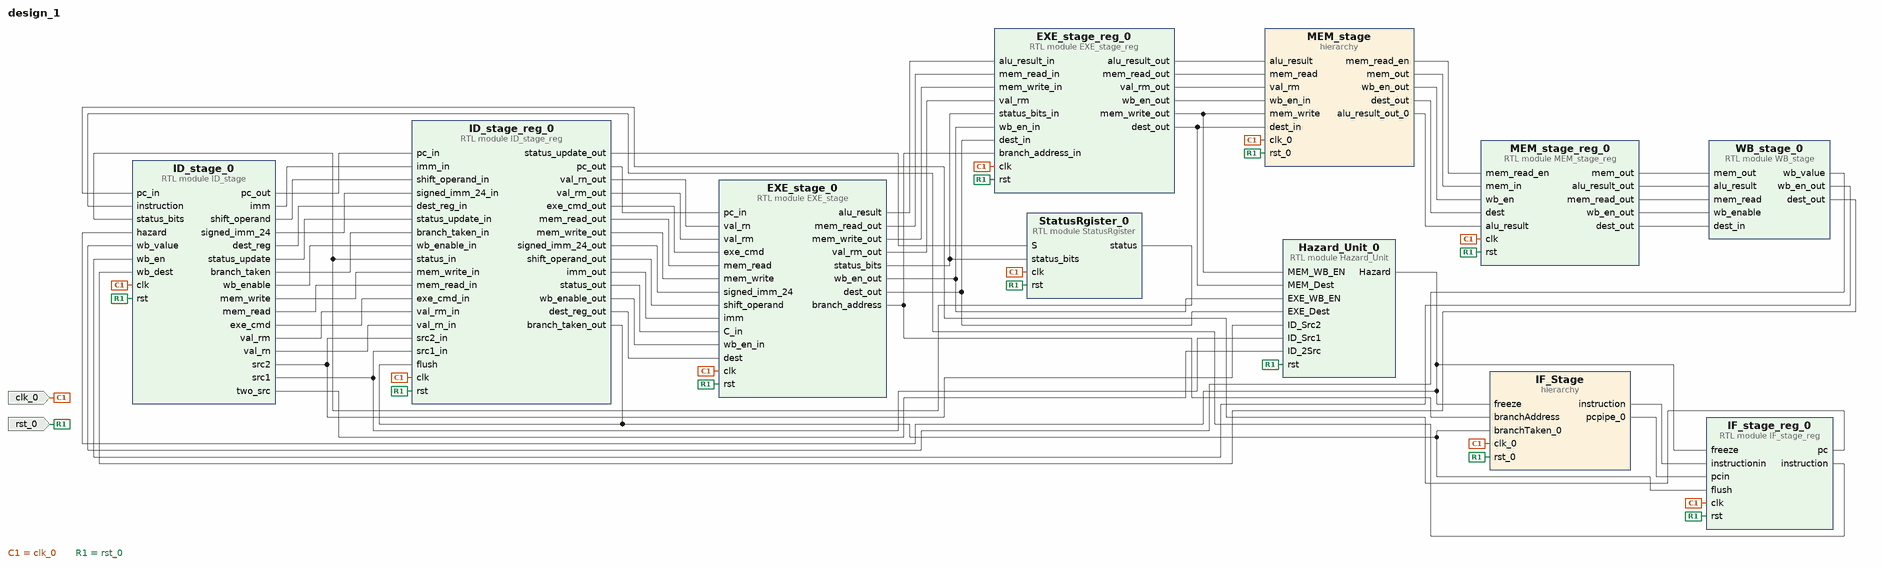
[diagram p0: block diagram of the top level]
# Vivado block design design_1, xc7z010clg400-1, Vivado 2018.3
create_bd_design design_1

create_bd_port -dir I -type clk clk_0
create_bd_port -dir I -type rst rst_0

create_bd_cell -type hier IF_Stage
create_bd_cell -type module -reference ID_stage_reg ID_stage_reg_0
create_bd_cell -type hier MEM_stage
create_bd_cell -type module -reference MEM_stage_reg MEM_stage_reg_0
create_bd_cell -type module -reference IF_stage_reg IF_stage_reg_0
create_bd_cell -type module -reference Hazard_Unit Hazard_Unit_0
create_bd_cell -type module -reference StatusRgister StatusRgister_0
create_bd_cell -type module -reference EXE_stage_reg EXE_stage_reg_0
create_bd_cell -type module -reference ID_stage ID_stage_0
create_bd_cell -type module -reference EXE_stage EXE_stage_0
create_bd_cell -type module -reference WB_stage WB_stage_0

# ---- hierarchy /IF_Stage ----
current_bd_instance /IF_Stage
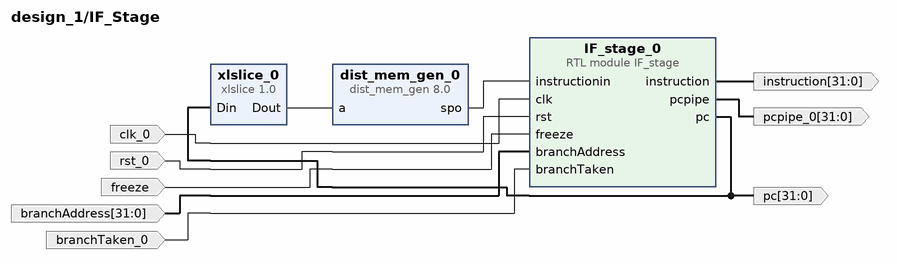
[diagram p1: block diagram inside /IF_Stage]
create_bd_pin -dir O -from 31 -to 0 pc
create_bd_pin -dir I -type clk clk_0
create_bd_pin -dir I -type rst rst_0
create_bd_pin -dir I freeze
create_bd_pin -dir I -from 31 -to 0 branchAddress
create_bd_pin -dir O -from 31 -to 0 instruction
create_bd_pin -dir O -from 31 -to 0 pcpipe_0
create_bd_pin -dir I branchTaken_0

create_bd_cell -type ip -vlnv xilinx.com:ip:xlslice:1.0 xlslice_0
set_property -dict {CONFIG.DIN_FROM 12 CONFIG.DOUT_WIDTH 13} [get_bd_cells xlslice_0]
create_bd_cell -type ip -vlnv xilinx.com:ip:dist_mem_gen:8.0 dist_mem_gen_0
set_property -dict [list \
  CONFIG.coefficient_file ../../../../../../../output_ultimate.coe \
  CONFIG.data_width 32 \
  CONFIG.depth 8192 \
  CONFIG.memory_type rom \
] [get_bd_cells dist_mem_gen_0]
create_bd_cell -type module -reference IF_stage IF_stage_0

# ---- hierarchy /MEM_stage ----
current_bd_instance /MEM_stage
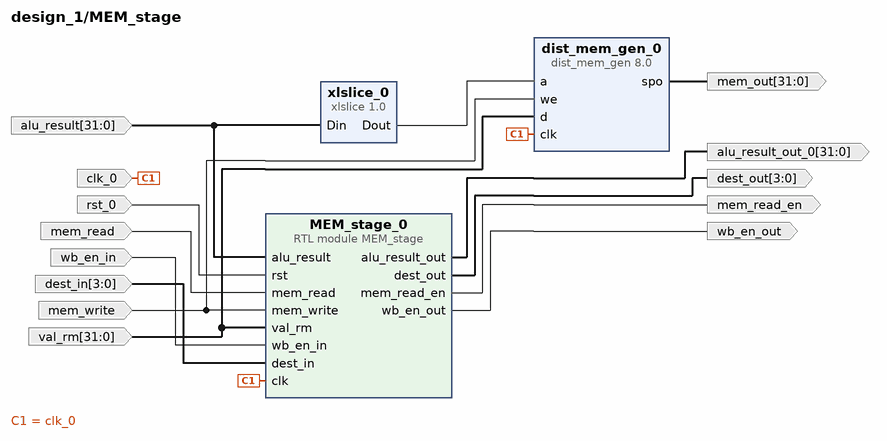
[diagram p2: block diagram inside /MEM_stage]
create_bd_pin -dir I -type clk clk_0
create_bd_pin -dir I -type rst rst_0
create_bd_pin -dir I mem_read
create_bd_pin -dir I mem_write
create_bd_pin -dir I -from 31 -to 0 alu_result
create_bd_pin -dir I -from 31 -to 0 val_rm
create_bd_pin -dir I wb_en_in
create_bd_pin -dir I -from 3 -to 0 dest_in
create_bd_pin -dir O -from 31 -to 0 mem_out
create_bd_pin -dir O mem_read_en
create_bd_pin -dir O wb_en_out
create_bd_pin -dir O -from 3 -to 0 dest_out
create_bd_pin -dir O -from 31 -to 0 alu_result_out_0

create_bd_cell -type ip -vlnv xilinx.com:ip:dist_mem_gen:8.0 dist_mem_gen_0
set_property -dict {CONFIG.data_width 32 CONFIG.depth 2048 CONFIG.memory_type single_port_ram} [get_bd_cells dist_mem_gen_0]
create_bd_cell -type ip -vlnv xilinx.com:ip:xlslice:1.0 xlslice_0
set_property -dict {CONFIG.DIN_FROM 10 CONFIG.DOUT_WIDTH 11} [get_bd_cells xlslice_0]
create_bd_cell -type module -reference MEM_stage MEM_stage_0

# ---- connections ----

current_bd_instance /IF_Stage
connect_bd_net [get_bd_pins IF_stage_0/pc] [get_bd_pins pc] [get_bd_pins xlslice_0/Din]
connect_bd_net -net clk_0_1 [get_bd_pins clk_0] [get_bd_pins IF_stage_0/clk]
connect_bd_net -net rst_0_1 [get_bd_pins rst_0] [get_bd_pins IF_stage_0/rst]
connect_bd_net -net xlconstant_0_dout [get_bd_pins freeze] [get_bd_pins IF_stage_0/freeze]
connect_bd_net -net xlconstant_1_dout [get_bd_pins branchAddress] [get_bd_pins IF_stage_0/branchAddress]
connect_bd_net [get_bd_pins IF_stage_0/instruction] [get_bd_pins instruction]
connect_bd_net [get_bd_pins IF_stage_0/pcpipe] [get_bd_pins pcpipe_0]
connect_bd_net [get_bd_pins xlslice_0/Dout] [get_bd_pins dist_mem_gen_0/a]
connect_bd_net [get_bd_pins dist_mem_gen_0/spo] [get_bd_pins IF_stage_0/instructionin]
connect_bd_net -net branchTaken_0_1 [get_bd_pins branchTaken_0] [get_bd_pins IF_stage_0/branchTaken]

current_bd_instance /MEM_stage
connect_bd_net -net clk_0_1 [get_bd_pins clk_0] [get_bd_pins dist_mem_gen_0/clk] [get_bd_pins MEM_stage_0/clk]
connect_bd_net -net debouncer_0_SIGNAL_O [get_bd_pins rst_0] [get_bd_pins MEM_stage_0/rst]
connect_bd_net -net EXE_stage_reg_0_mem_read_out [get_bd_pins mem_read] [get_bd_pins MEM_stage_0/mem_read]
connect_bd_net -net EXE_stage_reg_0_mem_write_out [get_bd_pins mem_write] [get_bd_pins dist_mem_gen_0/we] [get_bd_pins MEM_stage_0/mem_write]
connect_bd_net -net EXE_stage_reg_0_alu_result_out [get_bd_pins alu_result] [get_bd_pins xlslice_0/Din] [get_bd_pins MEM_stage_0/alu_result]
connect_bd_net -net EXE_stage_reg_0_val_rm_out [get_bd_pins val_rm] [get_bd_pins dist_mem_gen_0/d] [get_bd_pins MEM_stage_0/val_rm]
connect_bd_net -net EXE_stage_reg_0_wb_en_out [get_bd_pins wb_en_in] [get_bd_pins MEM_stage_0/wb_en_in]
connect_bd_net -net EXE_stage_reg_0_dest_out [get_bd_pins dest_in] [get_bd_pins MEM_stage_0/dest_in]
connect_bd_net -net MEM_stage_0_mem_out [get_bd_pins dist_mem_gen_0/spo] [get_bd_pins mem_out]
connect_bd_net [get_bd_pins MEM_stage_0/mem_read_en] [get_bd_pins mem_read_en]
connect_bd_net [get_bd_pins MEM_stage_0/wb_en_out] [get_bd_pins wb_en_out]
connect_bd_net [get_bd_pins MEM_stage_0/dest_out] [get_bd_pins dest_out]
connect_bd_net [get_bd_pins xlslice_0/Dout] [get_bd_pins dist_mem_gen_0/a]
connect_bd_net [get_bd_pins MEM_stage_0/alu_result_out] [get_bd_pins alu_result_out_0]

current_bd_instance /
connect_bd_net -net IF_stage_0_instruction [get_bd_pins IF_Stage/instruction] [get_bd_pins IF_stage_reg_0/instructionin]
connect_bd_net -net clk_0_1 [get_bd_ports clk_0] \
  [get_bd_pins IF_Stage/clk_0] [get_bd_pins ID_stage_reg_0/clk] [get_bd_pins MEM_stage/clk_0] \
  [get_bd_pins MEM_stage_reg_0/clk] [get_bd_pins IF_stage_reg_0/clk] [get_bd_pins StatusRgister_0/clk] \
  [get_bd_pins EXE_stage_reg_0/clk] [get_bd_pins ID_stage_0/clk] [get_bd_pins EXE_stage_0/clk]
connect_bd_net [get_bd_pins IF_Stage/pcpipe_0] [get_bd_pins IF_stage_reg_0/pcin]
connect_bd_net [get_bd_pins IF_stage_reg_0/pc] [get_bd_pins ID_stage_0/pc_in]
connect_bd_net [get_bd_pins IF_stage_reg_0/instruction] [get_bd_pins ID_stage_0/instruction]
connect_bd_net [get_bd_pins ID_stage_0/pc_out] [get_bd_pins ID_stage_reg_0/pc_in]
connect_bd_net [get_bd_pins ID_stage_0/src2] [get_bd_pins ID_stage_reg_0/src2_in] [get_bd_pins Hazard_Unit_0/ID_Src2]
connect_bd_net [get_bd_pins ID_stage_0/src1] [get_bd_pins ID_stage_reg_0/src1_in] [get_bd_pins Hazard_Unit_0/ID_Src1]
connect_bd_net [get_bd_pins ID_stage_0/imm] [get_bd_pins ID_stage_reg_0/imm_in]
connect_bd_net [get_bd_pins ID_stage_0/shift_operand] [get_bd_pins ID_stage_reg_0/shift_operand_in]
connect_bd_net [get_bd_pins ID_stage_0/signed_imm_24] [get_bd_pins ID_stage_reg_0/signed_imm_24_in]
connect_bd_net [get_bd_pins ID_stage_0/dest_reg] [get_bd_pins ID_stage_reg_0/dest_reg_in]
connect_bd_net [get_bd_pins ID_stage_0/status_update] [get_bd_pins ID_stage_reg_0/status_update_in]
connect_bd_net [get_bd_pins ID_stage_0/branch_taken] [get_bd_pins ID_stage_reg_0/branch_taken_in]
connect_bd_net [get_bd_pins ID_stage_0/wb_enable] [get_bd_pins ID_stage_reg_0/wb_enable_in]
connect_bd_net [get_bd_pins ID_stage_0/mem_write] [get_bd_pins ID_stage_reg_0/mem_write_in]
connect_bd_net [get_bd_pins ID_stage_0/mem_read] [get_bd_pins ID_stage_reg_0/mem_read_in]
connect_bd_net [get_bd_pins ID_stage_0/exe_cmd] [get_bd_pins ID_stage_reg_0/exe_cmd_in]
connect_bd_net [get_bd_pins ID_stage_0/val_rm] [get_bd_pins ID_stage_reg_0/val_rm_in]
connect_bd_net [get_bd_pins ID_stage_0/val_rn] [get_bd_pins ID_stage_reg_0/val_rn_in]
connect_bd_net [get_bd_pins ID_stage_reg_0/pc_out] [get_bd_pins EXE_stage_0/pc_in]
connect_bd_net [get_bd_pins ID_stage_reg_0/val_rn_out] [get_bd_pins EXE_stage_0/val_rn]
connect_bd_net [get_bd_pins ID_stage_reg_0/val_rm_out] [get_bd_pins EXE_stage_0/val_rm]
connect_bd_net [get_bd_pins ID_stage_reg_0/exe_cmd_out] [get_bd_pins EXE_stage_0/exe_cmd]
connect_bd_net [get_bd_pins ID_stage_reg_0/mem_read_out] [get_bd_pins EXE_stage_0/mem_read]
connect_bd_net [get_bd_pins ID_stage_reg_0/mem_write_out] [get_bd_pins EXE_stage_0/mem_write]
connect_bd_net [get_bd_pins ID_stage_reg_0/signed_imm_24_out] [get_bd_pins EXE_stage_0/signed_imm_24]
connect_bd_net [get_bd_pins ID_stage_reg_0/shift_operand_out] [get_bd_pins EXE_stage_0/shift_operand]
connect_bd_net [get_bd_pins ID_stage_reg_0/imm_out] [get_bd_pins EXE_stage_0/imm]
connect_bd_net [get_bd_pins EXE_stage_0/alu_result] [get_bd_pins EXE_stage_reg_0/alu_result_in]
connect_bd_net [get_bd_pins EXE_stage_0/branch_address] [get_bd_pins IF_Stage/branchAddress] [get_bd_pins EXE_stage_reg_0/branch_address_in]
connect_bd_net [get_bd_pins ID_stage_reg_0/status_update_out] [get_bd_pins StatusRgister_0/S]
connect_bd_net [get_bd_pins StatusRgister_0/status] [get_bd_pins ID_stage_reg_0/status_in] [get_bd_pins ID_stage_0/status_bits]
connect_bd_net [get_bd_pins ID_stage_reg_0/status_out] [get_bd_pins EXE_stage_0/C_in]
connect_bd_net [get_bd_pins EXE_stage_0/status_bits] [get_bd_pins StatusRgister_0/status_bits] [get_bd_pins EXE_stage_reg_0/status_bits_in]
connect_bd_net [get_bd_pins ID_stage_reg_0/branch_taken_out] \
  [get_bd_pins IF_Stage/branchTaken_0] [get_bd_pins ID_stage_reg_0/flush] [get_bd_pins IF_stage_reg_0/flush]
connect_bd_net -net debouncer_0_SIGNAL_O [get_bd_ports rst_0] \
  [get_bd_pins IF_Stage/rst_0] [get_bd_pins ID_stage_reg_0/rst] [get_bd_pins MEM_stage/rst_0] \
  [get_bd_pins MEM_stage_reg_0/rst] [get_bd_pins IF_stage_reg_0/rst] [get_bd_pins Hazard_Unit_0/rst] \
  [get_bd_pins StatusRgister_0/rst] [get_bd_pins EXE_stage_reg_0/rst] [get_bd_pins ID_stage_0/rst] \
  [get_bd_pins EXE_stage_0/rst]
connect_bd_net [get_bd_pins EXE_stage_reg_0/alu_result_out] [get_bd_pins MEM_stage/alu_result]
connect_bd_net [get_bd_pins EXE_stage_reg_0/mem_write_out] [get_bd_pins MEM_stage/mem_write] [get_bd_pins Hazard_Unit_0/MEM_WB_EN]
connect_bd_net [get_bd_pins EXE_stage_reg_0/mem_read_out] [get_bd_pins MEM_stage/mem_read]
connect_bd_net [get_bd_pins EXE_stage_0/mem_read_out] [get_bd_pins EXE_stage_reg_0/mem_read_in]
connect_bd_net [get_bd_pins EXE_stage_0/mem_write_out] [get_bd_pins EXE_stage_reg_0/mem_write_in]
connect_bd_net [get_bd_pins EXE_stage_0/val_rm_out] [get_bd_pins EXE_stage_reg_0/val_rm]
connect_bd_net [get_bd_pins EXE_stage_reg_0/val_rm_out] [get_bd_pins MEM_stage/val_rm]
connect_bd_net -net MEM_stage_0_mem_read_en [get_bd_pins MEM_stage/mem_read_en] [get_bd_pins MEM_stage_reg_0/mem_read_en]
connect_bd_net -net MEM_stage_0_mem_out [get_bd_pins MEM_stage/mem_out] [get_bd_pins MEM_stage_reg_0/mem_in]
connect_bd_net [get_bd_pins ID_stage_reg_0/wb_enable_out] [get_bd_pins EXE_stage_0/wb_en_in]
connect_bd_net [get_bd_pins EXE_stage_0/wb_en_out] [get_bd_pins Hazard_Unit_0/EXE_WB_EN] [get_bd_pins EXE_stage_reg_0/wb_en_in]
connect_bd_net [get_bd_pins EXE_stage_reg_0/wb_en_out] [get_bd_pins MEM_stage/wb_en_in]
connect_bd_net -net MEM_stage_0_wb_en_out [get_bd_pins MEM_stage/wb_en_out] [get_bd_pins MEM_stage_reg_0/wb_en]
connect_bd_net [get_bd_pins MEM_stage_reg_0/mem_out] [get_bd_pins WB_stage_0/mem_out]
connect_bd_net [get_bd_pins MEM_stage_reg_0/alu_result_out] [get_bd_pins WB_stage_0/alu_result]
connect_bd_net [get_bd_pins MEM_stage_reg_0/mem_read_out] [get_bd_pins WB_stage_0/mem_read]
connect_bd_net [get_bd_pins MEM_stage_reg_0/wb_en_out] [get_bd_pins WB_stage_0/wb_enable]
connect_bd_net [get_bd_pins Hazard_Unit_0/Hazard] [get_bd_pins IF_Stage/freeze] [get_bd_pins IF_stage_reg_0/freeze] [get_bd_pins ID_stage_0/hazard]
connect_bd_net [get_bd_pins ID_stage_reg_0/dest_reg_out] [get_bd_pins EXE_stage_0/dest]
connect_bd_net [get_bd_pins EXE_stage_0/dest_out] [get_bd_pins Hazard_Unit_0/EXE_Dest] [get_bd_pins EXE_stage_reg_0/dest_in]
connect_bd_net [get_bd_pins EXE_stage_reg_0/dest_out] [get_bd_pins MEM_stage/dest_in] [get_bd_pins Hazard_Unit_0/MEM_Dest]
connect_bd_net -net MEM_stage_0_dest_out [get_bd_pins MEM_stage/dest_out] [get_bd_pins MEM_stage_reg_0/dest]
connect_bd_net [get_bd_pins MEM_stage_reg_0/dest_out] [get_bd_pins WB_stage_0/dest_in]
connect_bd_net [get_bd_pins WB_stage_0/wb_value] [get_bd_pins ID_stage_0/wb_value]
connect_bd_net [get_bd_pins WB_stage_0/wb_en_out] [get_bd_pins ID_stage_0/wb_en]
connect_bd_net [get_bd_pins WB_stage_0/dest_out] [get_bd_pins ID_stage_0/wb_dest]
connect_bd_net [get_bd_pins MEM_stage/alu_result_out_0] [get_bd_pins MEM_stage_reg_0/alu_result]
connect_bd_net [get_bd_pins ID_stage_0/two_src] [get_bd_pins Hazard_Unit_0/ID_2Src]

validate_bd_design
save_bd_design
